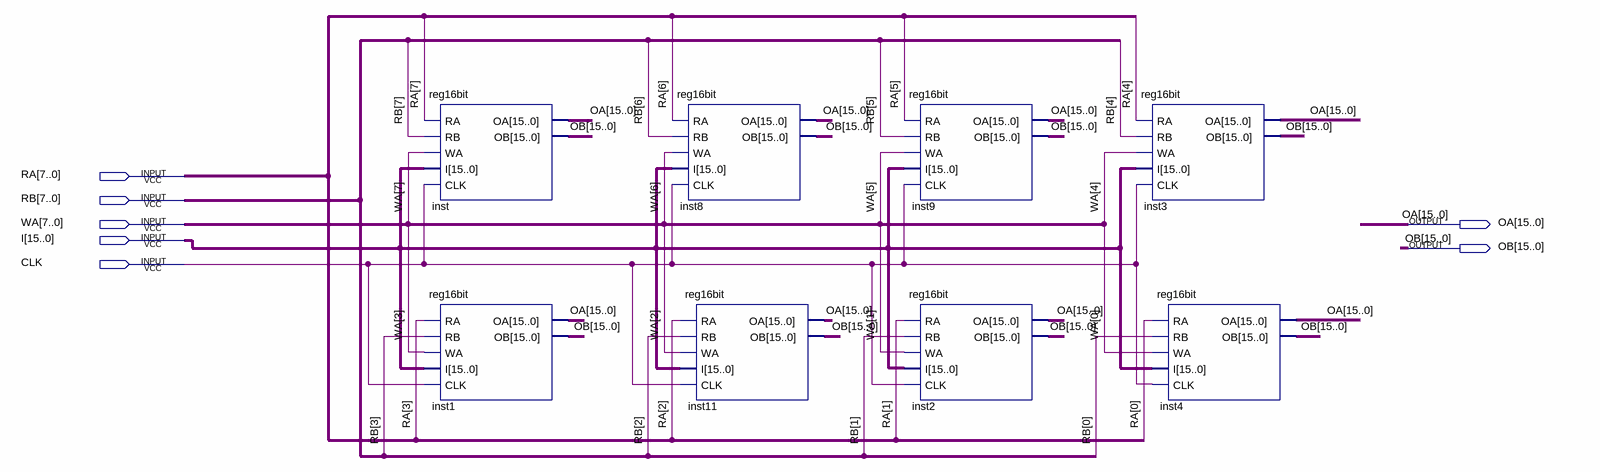
[diagram p0: schematic sheet]
// Quartus schematic reg8x16.bdf as structural Verilog: 8 symbols, 7 pins
module reg8x16 (
  input  [7:0] RA,
  input  [7:0] RB,
  input  [7:0] WA,
  input  [15:0] I,
  input  CLK,
  output [15:0] OA,
  output [15:0] OB
);

  reg16bit inst (.RA(RA[7]), .RB(RB[7]), .WA(WA[7]), .I(I), .CLK(CLK), .OA(OA), .OB(OB));
  reg16bit inst1 (.RA(RA[3]), .RB(RB[3]), .WA(WA[3]), .I(I), .CLK(CLK), .OA(OA), .OB(OB));
  reg16bit inst8 (.RA(RA[6]), .RB(RB[6]), .WA(WA[6]), .I(I), .CLK(CLK), .OA(OA), .OB(OB));
  reg16bit inst11 (.RA(RA[2]), .RB(RB[2]), .WA(WA[2]), .I(I), .CLK(CLK), .OA(OA), .OB(OB));
  reg16bit inst9 (.RA(RA[5]), .RB(RB[5]), .WA(WA[5]), .I(I), .CLK(CLK), .OA(OA), .OB(OB));
  reg16bit inst2 (.RA(RA[1]), .RB(RB[1]), .WA(WA[1]), .I(I), .CLK(CLK), .OA(OA), .OB(OB));
  reg16bit inst3 (.RA(RA[4]), .RB(RB[4]), .WA(WA[4]), .I(I), .CLK(CLK), .OA(OA), .OB(OB));
  reg16bit inst4 (.RA(RA[0]), .RB(RB[0]), .WA(WA[0]), .I(I), .CLK(CLK), .OA(OA), .OB(OB));
endmodule
